# Altium schematic sheet Copy of BMS_Slave Battery Monitor A.SchDoc
size E
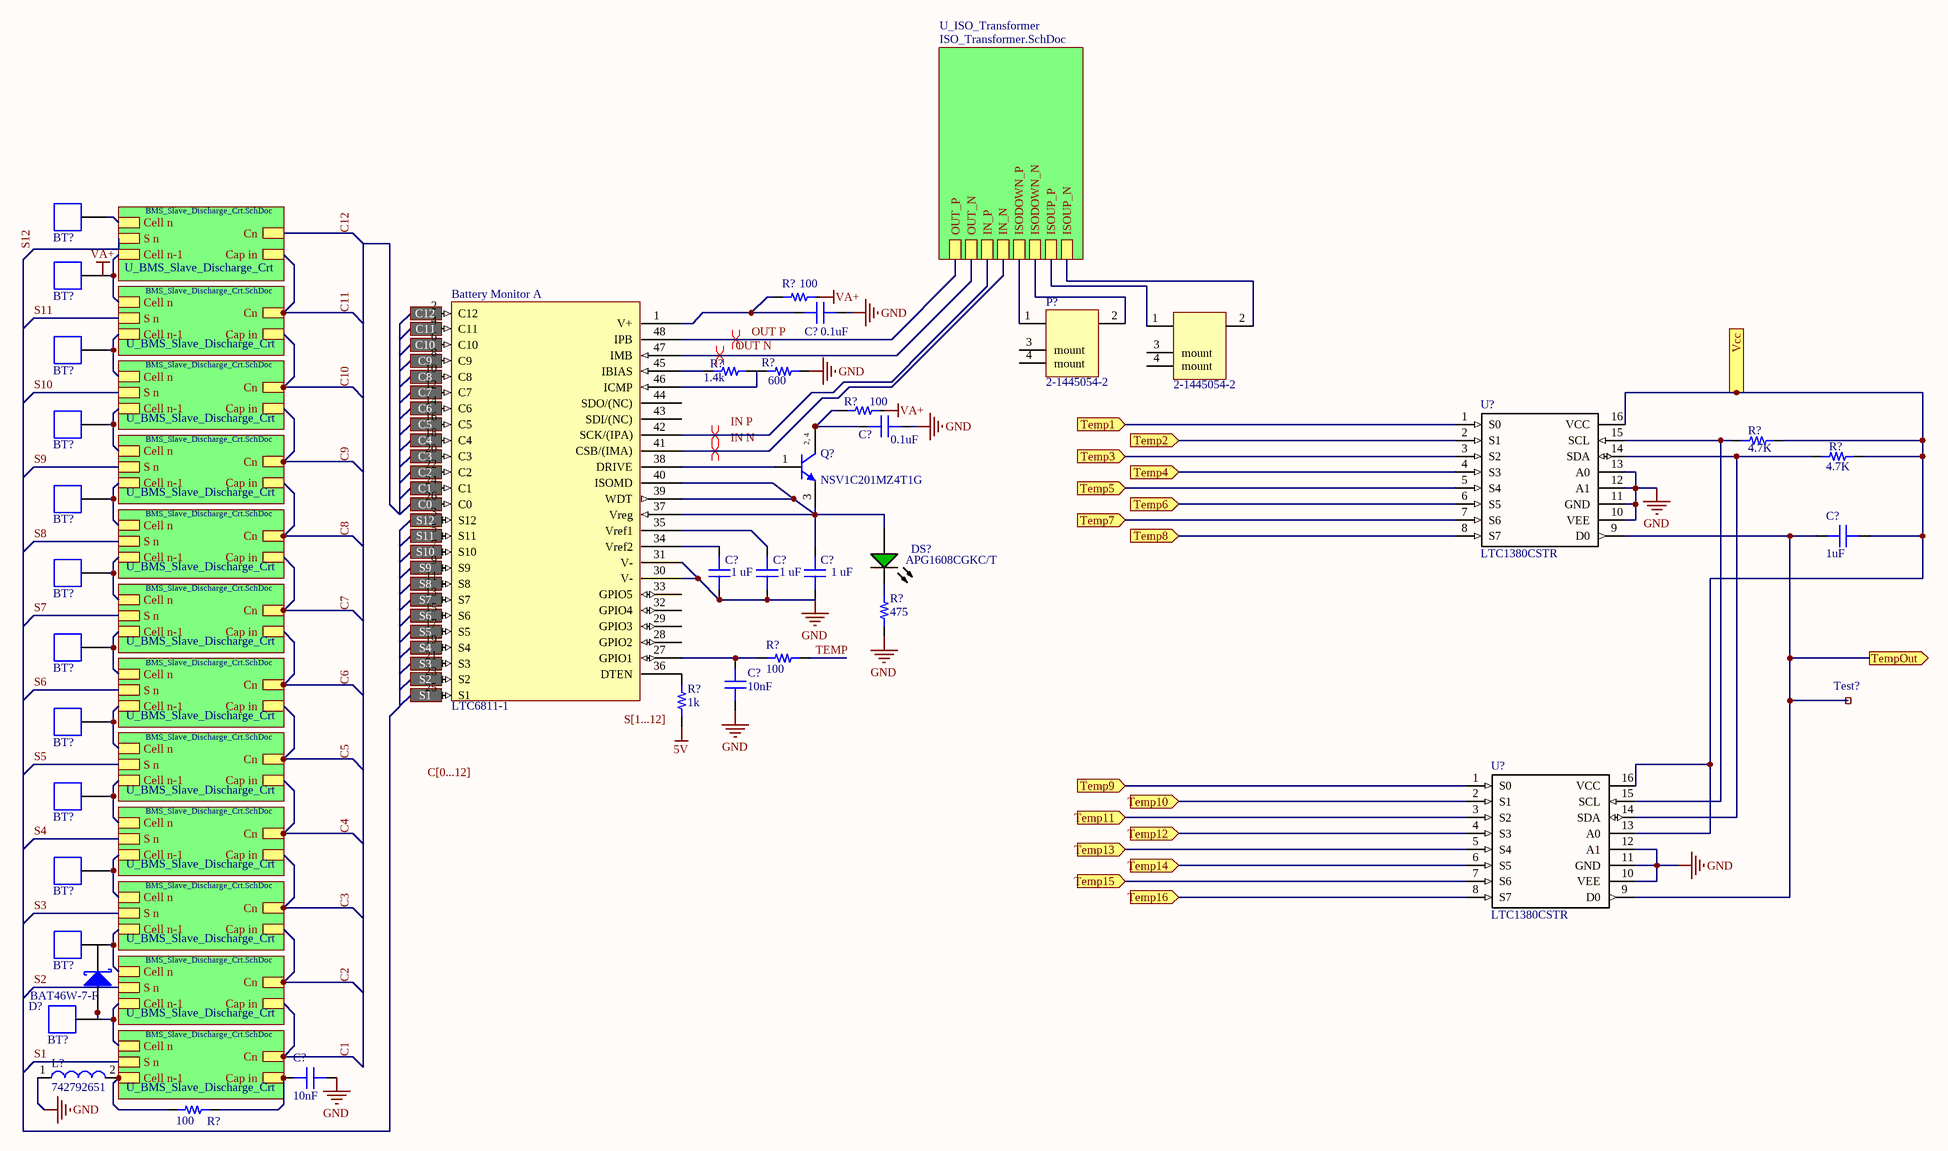
[diagram p0: Copy of BMS_Slave Battery Monitor A.SchDoc]

## Parts
(Parts that share a designator on the sheet are numbered #1, #2 ... from top to bottom, then left to right.)
Battery_Monitor_A  LTC6811-1  [LTC6811-1]
BT?#1  BAT+  [Battery]  (value not drawn)
BT?#2  BAT+  [Battery]  (value not drawn)
BT?#3  BAT+  [Battery]  (value not drawn)
BT?#4  BAT+  [Battery]  (value not drawn)
BT?#5  BAT+  [Battery]  (value not drawn)
BT?#6  BAT+  [Battery]  (value not drawn)
BT?#7  BAT+  [Battery]  (value not drawn)
BT?#8  BAT+  [Battery]  (value not drawn)
BT?#9  BAT+  [Battery]  (value not drawn)
BT?#10  BAT+  [Battery]  (value not drawn)
BT?#11  BAT+  [Battery]  (value not drawn)
BT?#12  BAT+  [Battery]  (value not drawn)
C?#1  capacitance: 0.1uF  [0603]  (hidden comment: capacitor)
C?#2  capacitance: 0.1uF  [0603]  (hidden comment: capacitor)
C?#3  capacitance: 1uF  [0603]  (hidden comment: capacitor)
C?#4  capacitance: 1 uF  [0603]  (hidden comment: capacitor)
C?#5  capacitance: 1 uF  [0603]  (hidden comment: capacitor)
C?#6  capacitance: 1 uF  [0603]  (hidden comment: capacitor)
C?#7  capacitance: 10nF  [0603]  (hidden comment: capacitor)
C?#8  capacitance: 10nF  [0603]  (hidden comment: capacitor)
D?  BAT46W-7-F  [DIOD-SOD-123-2_V]
DS?  APG1608CGKC/T  [KING-LED0603-25-GREEN_V]
L?  742792651  [SMD-0603]
P?  2-1445054-2  [2-1445054-2]
Q?  NSV1C201MZ4T1G  [ONSC-SOT-223-4-318E-04_V]
R?#1  resistance: 100  [0603]  (hidden comment: resistor)
R?#2  resistance: 1.4k  [0603]  (hidden comment: resistor)
R?#3  resistance: 600  [0603]  (hidden comment: resistor)
R?#4  resistance: 100  [0603]  (hidden comment: resistor)
R?#5  resistance: 4.7K  [0603]  (hidden comment: resistor)
R?#6  resistance: 4.7K  [0603]  (hidden comment: resistor)
R?#7  resistance: 475  [0603]  (hidden comment: resistor)
R?#8  resistance: 100  [0603]  (hidden comment: resistor)
R?#9  resistance: 1k  [0603]  (hidden comment: resistor)
R?#10  resistance: 100  [0603]  (hidden comment: resistor)
Test?  RCU-0C  [RCU-0C]  (value not drawn)
U?#1  LTC1380CSTR
U?#2  LTC1380CSTR
  2-1445054-2  [2-1445054-2]

## Sub-sheets
U_BMS_Slave_Discharge_Crt = BMS_Slave_Discharge_Crt.SchDoc: S n, Cap in, Cn, Cell n-1, Cell n
U_BMS_Slave_Discharge_Crt = BMS_Slave_Discharge_Crt.SchDoc: S n, Cap in, Cn, Cell n-1, Cell n
U_BMS_Slave_Discharge_Crt = BMS_Slave_Discharge_Crt.SchDoc: S n, Cap in, Cn, Cell n-1, Cell n
U_BMS_Slave_Discharge_Crt = BMS_Slave_Discharge_Crt.SchDoc: S n, Cap in, Cn, Cell n-1, Cell n
U_BMS_Slave_Discharge_Crt = BMS_Slave_Discharge_Crt.SchDoc: S n, Cap in, Cn, Cell n-1, Cell n
U_BMS_Slave_Discharge_Crt = BMS_Slave_Discharge_Crt.SchDoc: S n, Cap in, Cn, Cell n-1, Cell n
U_BMS_Slave_Discharge_Crt = BMS_Slave_Discharge_Crt.SchDoc: S n, Cap in, Cn, Cell n-1, Cell n
U_BMS_Slave_Discharge_Crt = BMS_Slave_Discharge_Crt.SchDoc: S n, Cap in, Cn, Cell n-1, Cell n
U_BMS_Slave_Discharge_Crt = BMS_Slave_Discharge_Crt.SchDoc: S n, Cap in, Cn, Cell n-1, Cell n
U_BMS_Slave_Discharge_Crt = BMS_Slave_Discharge_Crt.SchDoc: S n, Cap in, Cn, Cell n-1, Cell n
U_BMS_Slave_Discharge_Crt = BMS_Slave_Discharge_Crt.SchDoc: S n, Cap in, Cn, Cell n-1, Cell n
U_BMS_Slave_Discharge_Crt = BMS_Slave_Discharge_Crt.SchDoc: S n, Cap in, Cn, Cell n-1, Cell n
U_ISO_Transformer = ISO_Transformer.SchDoc: OUT_P, OUT_N, IN_P, IN_N, ISODOWN_P, ISODOWN_N, ISOUP_P, ISOUP_N

## Ports
C0, C1, C2, C3, C4, C5, C6, C7, C8, C9, C10, C11, C12, S1, S2, S3, S4, S5, S6, S7, S8, S9, S10, S11, S12, Temp1 (in), Temp2 (in), Temp3 (in), Temp4 (in), Temp5 (in), Temp6 (in), Temp7 (in), Temp8 (in), Temp9 (in), Temp10 (in), Temp11 (in), Temp12 (in), Temp13 (in), Temp14 (in), Temp15 (in), Temp16 (in), TempOut (out), Vcc

## Nets
5V: R?#9.1
GND: Battery_Monitor_A.30(V-) Battery_Monitor_A.31(V-) C?#1.1 C?#2.1 C?#4.1 C?#5.1 C?#6.1 C?#7.1 C?#8.1 L?.1 R?#3.2 R?#7.2 U?#1.10(VEE) U?#1.11(GND) U?#1.12(A1) U?#1.13(A0) U?#2.10(VEE) U?#2.11(GND) U?#2.12(A1)
C0: Battery_Monitor_A.26(C0) ; port C0
C1: Battery_Monitor_A.24(C1) ; port C1
C1: sheet U_BMS_Slave_Discharge_Crt/Cap in, sheet U_BMS_Slave_Discharge_Crt/Cn  [a separate net that carries the same name]
C2: Battery_Monitor_A.22(C2) ; port C2
C2: sheet U_BMS_Slave_Discharge_Crt/Cap in, sheet U_BMS_Slave_Discharge_Crt/Cn  [a separate net that carries the same name]
C3: Battery_Monitor_A.20(C3) ; port C3
C3: sheet U_BMS_Slave_Discharge_Crt/Cap in, sheet U_BMS_Slave_Discharge_Crt/Cn  [a separate net that carries the same name]
C4: Battery_Monitor_A.18(C4) ; port C4
C4: sheet U_BMS_Slave_Discharge_Crt/Cap in, sheet U_BMS_Slave_Discharge_Crt/Cn  [a separate net that carries the same name]
C5: Battery_Monitor_A.16(C5) ; port C5
C5: sheet U_BMS_Slave_Discharge_Crt/Cap in, sheet U_BMS_Slave_Discharge_Crt/Cn  [a separate net that carries the same name]
C6: Battery_Monitor_A.14(C6) ; port C6
C6: sheet U_BMS_Slave_Discharge_Crt/Cap in, sheet U_BMS_Slave_Discharge_Crt/Cn  [a separate net that carries the same name]
C7: Battery_Monitor_A.12(C7) ; port C7
C7: sheet U_BMS_Slave_Discharge_Crt/Cap in, sheet U_BMS_Slave_Discharge_Crt/Cn  [a separate net that carries the same name]
C8: Battery_Monitor_A.10(C8) ; port C8
C8: sheet U_BMS_Slave_Discharge_Crt/Cap in, sheet U_BMS_Slave_Discharge_Crt/Cn  [a separate net that carries the same name]
C9: Battery_Monitor_A.8(C9) ; port C9
C9: sheet U_BMS_Slave_Discharge_Crt/Cap in, sheet U_BMS_Slave_Discharge_Crt/Cn  [a separate net that carries the same name]
C10: Battery_Monitor_A.6(C10) ; port C10
C10: sheet U_BMS_Slave_Discharge_Crt/Cap in, sheet U_BMS_Slave_Discharge_Crt/Cn  [a separate net that carries the same name]
C11: Battery_Monitor_A.4(C11) ; port C11
C11: sheet U_BMS_Slave_Discharge_Crt/Cap in, sheet U_BMS_Slave_Discharge_Crt/Cn  [a separate net that carries the same name]
C12: Battery_Monitor_A.2(C12) ; port C12
C12: sheet U_BMS_Slave_Discharge_Crt/Cn  [a separate net that carries the same name]
S1: Battery_Monitor_A.25(S1) ; port S1
S1: sheet U_BMS_Slave_Discharge_Crt/S n  [a separate net that carries the same name]
S2: Battery_Monitor_A.23(S2) ; port S2
S2: sheet U_BMS_Slave_Discharge_Crt/S n  [a separate net that carries the same name]
S3: Battery_Monitor_A.21(S3) ; port S3
S3: sheet U_BMS_Slave_Discharge_Crt/S n  [a separate net that carries the same name]
S4: Battery_Monitor_A.19(S4) ; port S4
S4: sheet U_BMS_Slave_Discharge_Crt/S n  [a separate net that carries the same name]
S5: Battery_Monitor_A.17(S5) ; port S5
S5: sheet U_BMS_Slave_Discharge_Crt/S n  [a separate net that carries the same name]
S6: Battery_Monitor_A.15(S6) ; port S6
S6: sheet U_BMS_Slave_Discharge_Crt/S n  [a separate net that carries the same name]
S7: Battery_Monitor_A.13(S7) ; port S7
S7: sheet U_BMS_Slave_Discharge_Crt/S n  [a separate net that carries the same name]
S8: Battery_Monitor_A.11(S8) ; port S8
S8: sheet U_BMS_Slave_Discharge_Crt/S n  [a separate net that carries the same name]
S9: Battery_Monitor_A.9(S9) ; port S9
S9: sheet U_BMS_Slave_Discharge_Crt/S n  [a separate net that carries the same name]
S10: Battery_Monitor_A.7(S10) ; port S10
S10: sheet U_BMS_Slave_Discharge_Crt/S n  [a separate net that carries the same name]
S11: Battery_Monitor_A.5(S11) ; port S11
S11: sheet U_BMS_Slave_Discharge_Crt/S n  [a separate net that carries the same name]
S12: Battery_Monitor_A.3(S12) ; port S12
S12: sheet U_BMS_Slave_Discharge_Crt/S n  [a separate net that carries the same name]
Temp1: U?#1.1(S0) ; port Temp1
Temp2: U?#1.2(S1) ; port Temp2
Temp3: U?#1.3(S2) ; port Temp3
Temp4: U?#1.4(S3) ; port Temp4
Temp5: U?#1.5(S4) ; port Temp5
Temp6: U?#1.6(S5) ; port Temp6
Temp7: U?#1.7(S6) ; port Temp7
Temp8: U?#1.8(S7) ; port Temp8
Temp9: U?#2.1(S0) ; port Temp9
Temp10: U?#2.2(S1) ; port Temp10
Temp11: U?#2.3(S2) ; port Temp11
Temp12: U?#2.4(S3) ; port Temp12
Temp13: U?#2.5(S4) ; port Temp13
Temp14: U?#2.6(S5) ; port Temp14
Temp15: U?#2.7(S6) ; port Temp15
Temp16: U?#2.8(S7) ; port Temp16
TempOut: C?#3.1 Test?.1 U?#1.9(D0) U?#2.9(D0) ; port TempOut
Vcc: C?#3.2 R?#5.2 R?#6.2 U?#1.16(VCC) U?#2.13(A0) U?#2.16(VCC) ; port Vcc
Net_1: .1 ; sheet U_ISO_Transformer/ISOUP_P
Net_2: .2 ; sheet U_ISO_Transformer/ISOUP_N
NetBattery_Monitor_A_1: Battery_Monitor_A.1(V+) C?#1.2 R?#1.2
NetBattery_Monitor_A_27: Battery_Monitor_A.27(GPIO1) C?#7.2 R?#8.2
NetBattery_Monitor_A_34: Battery_Monitor_A.34(Vref2) C?#4.2
NetBattery_Monitor_A_35: Battery_Monitor_A.35(Vref1) C?#5.2
NetBattery_Monitor_A_36: Battery_Monitor_A.36(DTEN) R?#9.2
NetBattery_Monitor_A_37: Battery_Monitor_A.37(Vreg) Battery_Monitor_A.39(WDT) Battery_Monitor_A.40(ISOMD) C?#6.2 DS?.1(A) Q?.3(E)
NetBattery_Monitor_A_38: Battery_Monitor_A.38(DRIVE) Q?.1(B)
NetBattery_Monitor_A_41: Battery_Monitor_A.41(CSB/(IMA)) ; sheet U_ISO_Transformer/IN_N
NetBattery_Monitor_A_42: Battery_Monitor_A.42(SCK/(IPA)) ; sheet U_ISO_Transformer/IN_P
NetBattery_Monitor_A_45: Battery_Monitor_A.45(IBIAS) R?#2.1
NetBattery_Monitor_A_46: Battery_Monitor_A.46(ICMP) R?#2.2 R?#3.1
NetBattery_Monitor_A_47: Battery_Monitor_A.47(IMB) ; sheet U_ISO_Transformer/OUT_N
NetBattery_Monitor_A_48: Battery_Monitor_A.48(IPB) ; sheet U_ISO_Transformer/OUT_P
NetBT?#1_1: BT?#1.1 ; sheet U_BMS_Slave_Discharge_Crt/Cell n
NetBT?#2_1: BT?#2.1 ; sheet U_BMS_Slave_Discharge_Crt/Cell n-1, sheet U_BMS_Slave_Discharge_Crt/Cell n
NetBT?#3_1: BT?#3.1 ; sheet U_BMS_Slave_Discharge_Crt/Cell n-1, sheet U_BMS_Slave_Discharge_Crt/Cell n
NetBT?#4_1: BT?#4.1 ; sheet U_BMS_Slave_Discharge_Crt/Cell n-1, sheet U_BMS_Slave_Discharge_Crt/Cell n
NetBT?#5_1: BT?#5.1 ; sheet U_BMS_Slave_Discharge_Crt/Cell n-1, sheet U_BMS_Slave_Discharge_Crt/Cell n
NetBT?#6_1: BT?#6.1 ; sheet U_BMS_Slave_Discharge_Crt/Cell n-1, sheet U_BMS_Slave_Discharge_Crt/Cell n
NetBT?#7_1: BT?#7.1 ; sheet U_BMS_Slave_Discharge_Crt/Cell n-1, sheet U_BMS_Slave_Discharge_Crt/Cell n
NetBT?#8_1: BT?#8.1 ; sheet U_BMS_Slave_Discharge_Crt/Cell n-1, sheet U_BMS_Slave_Discharge_Crt/Cell n
NetBT?#9_1: BT?#9.1 ; sheet U_BMS_Slave_Discharge_Crt/Cell n-1, sheet U_BMS_Slave_Discharge_Crt/Cell n
NetBT?#10_1: BT?#10.1 ; sheet U_BMS_Slave_Discharge_Crt/Cell n-1, sheet U_BMS_Slave_Discharge_Crt/Cell n
NetBT?#11_1: BT?#11.1 ; sheet U_BMS_Slave_Discharge_Crt/Cell n-1, sheet U_BMS_Slave_Discharge_Crt/Cell n
NetBT?#12_1: BT?#12.1 ; sheet U_BMS_Slave_Discharge_Crt/Cell n-1, sheet U_BMS_Slave_Discharge_Crt/Cell n
NetC?#2_2: C?#2.2 Q?.2(C) Q?.4(C) R?#4.2
NetC?#8_2: C?#8.2 R?#10.1 ; sheet U_BMS_Slave_Discharge_Crt/Cap in
NetDS?_2: DS?.2(K) R?#7.1
NetL?_2: L?.2 R?#10.2 ; sheet U_BMS_Slave_Discharge_Crt/Cell n-1
NetP?_1: P?.1 ; sheet U_ISO_Transformer/ISODOWN_P
NetP?_2: P?.2 ; sheet U_ISO_Transformer/ISODOWN_N
NetR?#5_1: R?#5.1 U?#1.15(SCL) U?#2.15(SCL)
NetR?#6_1: R?#6.1 U?#1.14(SDA) U?#2.14(SDA)

Not connected (* = marked no-connect by the designer): Battery_Monitor_A 28(GPIO2) 29(GPIO3) 32(GPIO4) 33(GPIO5) 43(SDI/(NC)) 44(SDO/(NC)); D? 1(A) 2(K); P? 3(mount) 4(mount); R?#1 1; R?#4 1; R?#8 1;  3(mount) 4(mount)

## Layout directives
differential pair: NetBattery_Monitor_A_41, NetBattery_Monitor_A_42, NetBattery_Monitor_A_47, NetBattery_Monitor_A_48

## Notes on the sheet
- (near R?#2) OUT N
- OUT P
- (near R?#2) IN P
- IN N
- (near R?#8) TEMP
- Labels drawn without touching a wire or pin: C[0...12], S[1...12], VA+
- (in symbol 11) 2, 4

## Library data of the parts
Battery_Monitor_A = 37: id: 37; vcc: 40; voltageinmax: 55; name: LTC6811-1; package: SSOP; quantity: 0; link: https://www.analog.com/media/en/technical-documentation/data-sheets/68111fb.pdf
BT?#1-BT?#12 = Battery+
C?#1-C?#8 = 1: Generic 0603 capacitor; id: 1; voltage: 50; dielectric: Ceramic; percent tolerance: 10; name: 0603 Capacitor; ESR: 1; package: 0603; quantity: 0
D? = 21: SURFACE MOUNT SCHOTTKY BARRIER DIODE; Manufacturer: Diodes Inc; IR@1.5 V: 0.3 uA Max.; V(BR)R: 100 V Min.; VF@10 mA: 0.45 V Max.; CT@1 V: 12 pF Typ.; Packing: Tape and Reel; id: 21; vr: 100; PartNumber: BAT46W-7-F; ComponentLink1URL: http://www.diodes.com/; ComponentLink3URL: http://diodes.com/datasheets/ds30044.pdf; PackageDescription: 2-Pin SMD, Body 2.7 x 1.55 mm, Height 1.45 mm; ComponentLink2Description: Datasheet; ComponentLink3Description: Package Specification; Mounting Technology: Surface Mount; ComponentLink1Description: Manufacturer URL; RoHS: TRUE; Operating Temperature: -55 to 125 degC; ComponentLink2URL: http://diodes.com/datasheets/ds30044.pdf; DatasheetVersion: Rev. 16-2; name: BAT46W-7-F; package: SOD123; quantity: 0; link: https://www.diodes.com/assets/Datasheets/ds30044.pdf; createdby: J.Childers
DS? = 20: LED GREEN CLEAR CHIP SMD; Forward Current: 30 mA; Reverse Voltage: 5 V; Power Dissipation: 78 mW; Packing: Reel; id: 20; vr: 5; ComponentLink1Description: Manufacturer URL; ComponentLink1URL: http://www.kingbrightusa.com/; ComponentLink2URL: http://www.kingbrightusa.com/images/catalog/SPEC/APG1608CGKC-T.pdf; Mounting Technology: Surface Mount; Storage Temperature: -40 to 85 degC; DatasheetVersion: Rev. 5B, 10/2012; PartNumber: APG1608CGKC/T; PackageReference: LED0603-25-GREEN; ComponentLink2Description: Datasheet; PackageDescription: 2-Pin SMT LED, 1.6 x 0.8 mm Body, 0.25mm Thickness; PackageVersion: Rev. 5B, 10/2012; name: APG1608CGKC/T; package: CT; quantity: 0; link: http://www.kingbrightusa.com/images/catalog/SPEC/APG1608CGKC-T.pdf
L? = 9: Ferrite Bead; Impedance: 600 Ohm; id: 9; PackageReference: SMD-0603; PackageVersion: 2009; ComponentLink2Description: Datasheet; ComponentLink1Description: Manufacturer Link; ComponentLink2URL: http://www.we-online.de/katalog/media/pdf/742792651.pdf; DatasheetVersion: Dec-2005; ComponentLink1URL: http://www.we-online.com; PackageDescription: Chip Inductor, 2-Leads, Body 1.6 x 0.8 mm
P?  = 16: Micro MATE-N-LOK 1x2; id: 16; numcontacts: 2; numrows: 1; name: 2-1445054-2; quantity: 0; link: https://www.digikey.com/products/en?keywords=2-1445054-2
Q? = 11: Manufacturer: On Semiconductor; IC Continuous (A): 2; Note1: 0; Polarity: NPN; Packing: Tape and Reel; id: 11; beta: 360; vcemax: 0.180000007152557; PackageReference: SOT-223-4-318E-04; ComponentLink3URL: http://www.onsemi.com/pub_link/Collateral/318E-04.PDF; RoHS: TRUE; PackageDescription: 4-Pin Small Outline Transistor, Body 6.5 x 3.5 mm, Pitch 2.3 mm; DatasheetVersion: Rev. 4; Mounting Technology: Surface Mount; ComponentLink1Description: Manufacturer URL; ComponentLink1URL: http://www.onsemi.com/; PackageVersion: Rev. N, 08/2009; ComponentLink2Description: Datasheet; ComponentLink2URL: http://www.onsemi.cn/pub_link/Collateral/NSS1C201MZ4-D.PDF; ComponentLink3Description: Package Specification; PartNumber: NSV1C201MZ4T1G; name: NSV1C201MZ4T1G; type: NPN; ic: 2; package: SOT-223; quantity: 0; link: https://www.mouser.com/datasheet/2/308/NSS1C201MZ4-D-356308.pdf; createdby: J.Childers; createddate: 10/5/2019 9:17:00 AM
R?#1-R?#10 = 1: id: 1; name: 0603 Resistor; percent tolerance: 5; package: 0603; quantity: 0
Test? = 14: id: 14; numcontacts: 1; name: RCU-0C; numrows: 1; quantity: 0; link: https://www.digikey.com/product-detail/en/te-connectivity-amp-connectors/RCU-0C/A106145CT-ND/3477802